# Altium schematic sheet main_sch.SchDoc
size C; SheetNumber: 1; SheetTotal: 1
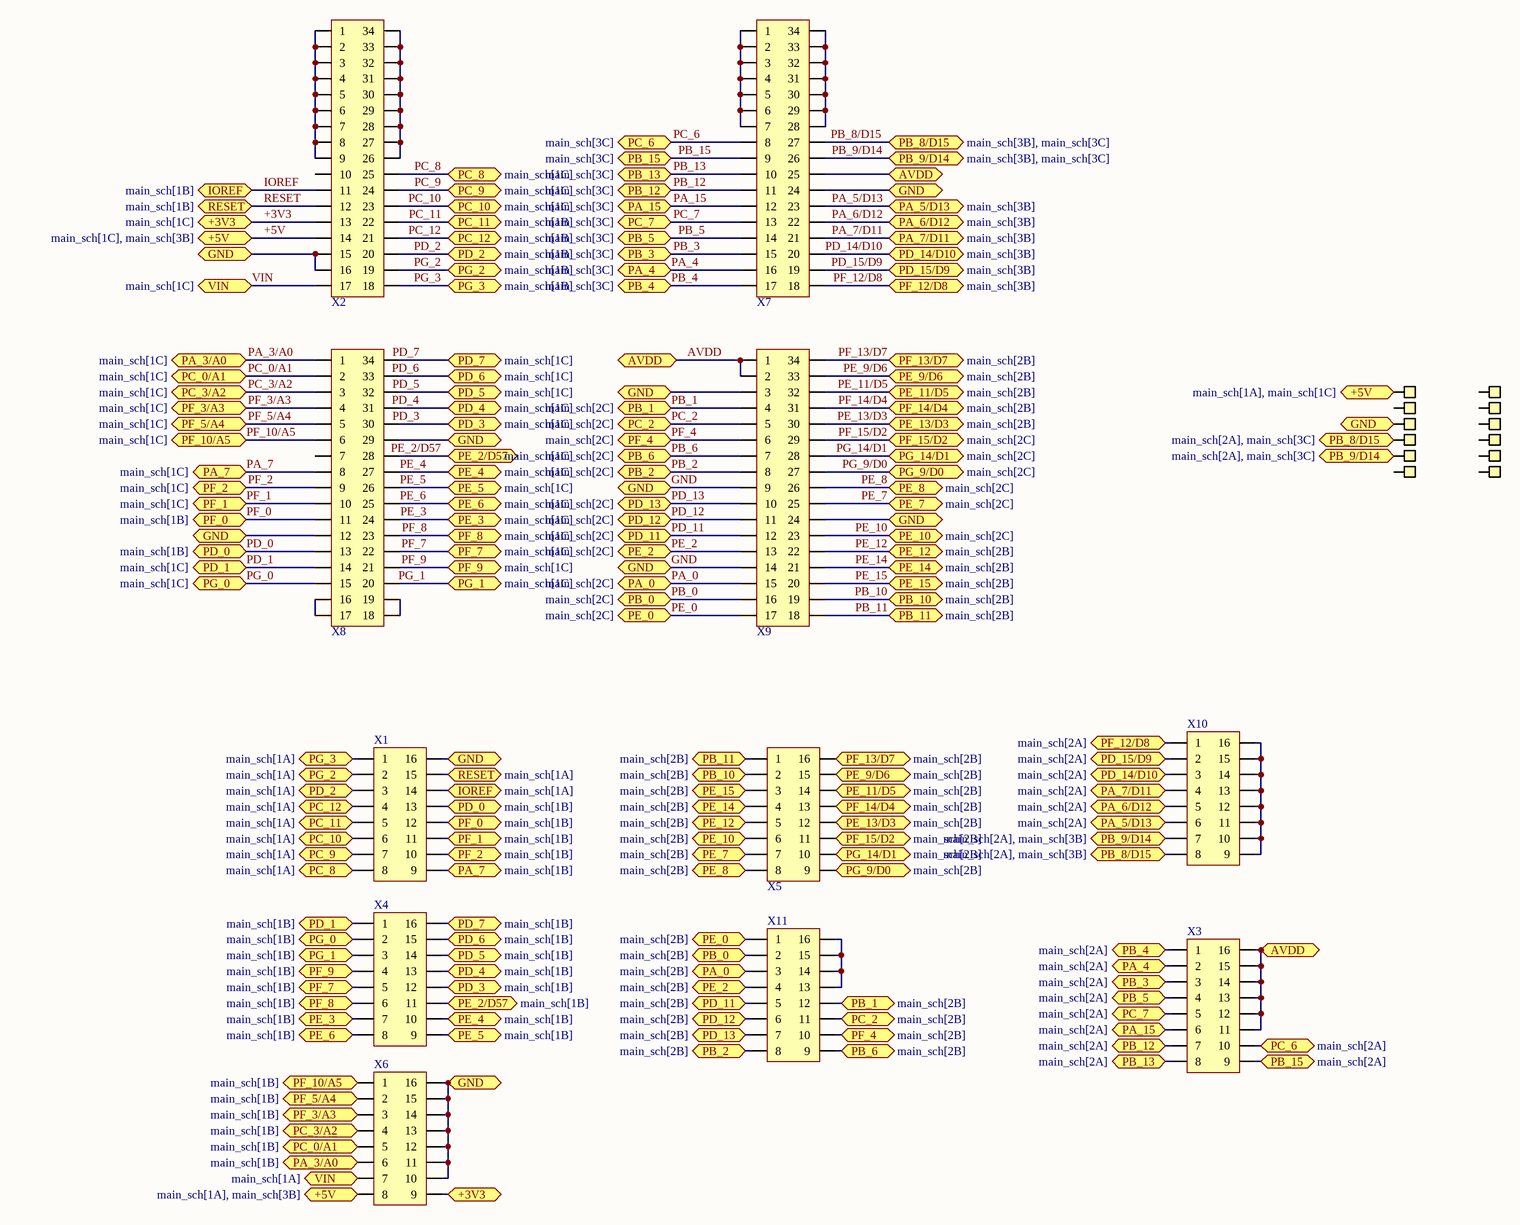
[diagram p0: main_sch.SchDoc]

## Parts
X1  TERM BLOCK 16POS 45DEG 5MM PCB  [PHEONIX-1988943]  (value not drawn)
X2  (no value)  [2x17PinHeader_0.1in]
X3  TERM BLOCK 16POS 45DEG 5MM PCB  [PHEONIX-1988943]  (value not drawn)
X4  TERM BLOCK 16POS 45DEG 5MM PCB  [PHEONIX-1988943]  (value not drawn)
X5  TERM BLOCK 16POS 45DEG 5MM PCB  [PHEONIX-1988943]  (value not drawn)
X6  TERM BLOCK 16POS 45DEG 5MM PCB  [PHEONIX-1988943]  (value not drawn)
X7  (no value)  [2x17PinHeader_0.1in]
X8  (no value)  [2x17PinHeader_0.1in]
X9  (no value)  [2x17PinHeader_0.1in]
X10  TERM BLOCK 16POS 45DEG 5MM PCB  [PHEONIX-1988943]  (value not drawn)
X11  TERM BLOCK 16POS 45DEG 5MM PCB  [PHEONIX-1988943]  (value not drawn)
X12  GenericPinHeader(0.1in)  [GenericPinHeader(.1in)]  (value not drawn)
X13  GenericPinHeader(0.1in)  [GenericPinHeader(.1in)]  (value not drawn)
X14  GenericPinHeader(0.1in)  [GenericPinHeader(.1in)]  (value not drawn)
X15  GenericPinHeader(0.1in)  [GenericPinHeader(.1in)]  (value not drawn)
X16  GenericPinHeader(0.1in)  [GenericPinHeader(.1in)]  (value not drawn)
X17  GenericPinHeader(0.1in)  [GenericPinHeader(.1in)]  (value not drawn)
X18  GenericPinHeader(0.1in)  [GenericPinHeader(.1in)]  (value not drawn)
X19  GenericPinHeader(0.1in)  [GenericPinHeader(.1in)]  (value not drawn)
X20  GenericPinHeader(0.1in)  [GenericPinHeader(.1in)]  (value not drawn)
X21  GenericPinHeader(0.1in)  [GenericPinHeader(.1in)]  (value not drawn)
X22  GenericPinHeader(0.1in)  [GenericPinHeader(.1in)]  (value not drawn)
X23  GenericPinHeader(0.1in)  [GenericPinHeader(.1in)]  (value not drawn)

## Ports
+3V3 (bidir, see main_sch[1A]), +3V3 (bidir, see main_sch[1C]), +5V (bidir, see main_sch[1A], main_sch[1C]), +5V (bidir, see main_sch[1A], main_sch[3B]), +5V (bidir, see main_sch[1C], main_sch[3B]), AVDD (bidir, see main_sch[2A], main_sch[2B]), AVDD (bidir, see main_sch[2A], main_sch[3C]), AVDD (bidir, see main_sch[2B], main_sch[3C]), GND (bidir, see main_sch[1A], main_sch[1B], main_sch[1C], main_sch[2A], main_sch[2B]), GND (bidir, see main_sch[1A], main_sch[1B], main_sch[1C], main_sch[2A], main_sch[2B], main_sch[3B]), GND (bidir, see main_sch[1A], main_sch[1B], main_sch[1C], main_sch[2B], main_sch[3B]), GND (bidir, see main_sch[1A], main_sch[1B], main_sch[2A], main_sch[2B], main_sch[3B]), GND (bidir, see main_sch[1B], main_sch[1C], main_sch[2A], main_sch[2B], main_sch[3B]), IOREF (bidir, see main_sch[1A]), IOREF (bidir, see main_sch[1B]), PA_0 (bidir, see main_sch[2B]), PA_0 (bidir, see main_sch[2C]), PA_3/A0 (bidir, see main_sch[1B]), PA_3/A0 (bidir, see main_sch[1C]), PA_4 (bidir, see main_sch[2A]), PA_4 (bidir, see main_sch[3C]), PA_5/D13 (bidir, see main_sch[2A]), PA_5/D13 (bidir, see main_sch[3B]), PA_6/D12 (bidir, see main_sch[2A]), PA_6/D12 (bidir, see main_sch[3B]), PA_7 (bidir, see main_sch[1B]), PA_7 (bidir, see main_sch[1C]), PA_7/D11 (bidir, see main_sch[2A]), PA_7/D11 (bidir, see main_sch[3B]), PA_15 (bidir, see main_sch[2A]), PA_15 (bidir, see main_sch[3C]), PB_0 (bidir, see main_sch[2B]), PB_0 (bidir, see main_sch[2C]), PB_1 (bidir, see main_sch[2B]), PB_1 (bidir, see main_sch[2C]), PB_2 (bidir, see main_sch[2B]), PB_2 (bidir, see main_sch[2C]), PB_3 (bidir, see main_sch[2A]), PB_3 (bidir, see main_sch[3C]), PB_4 (bidir, see main_sch[2A]), PB_4 (bidir, see main_sch[3C]), PB_5 (bidir, see main_sch[2A]), PB_5 (bidir, see main_sch[3C]), PB_6 (bidir, see main_sch[2B]), PB_6 (bidir, see main_sch[2C]), PB_8/D15 (bidir, see main_sch[2A], main_sch[3B]), PB_8/D15 (bidir, see main_sch[2A], main_sch[3C]), PB_8/D15 (bidir, see main_sch[3B], main_sch[3C]), PB_9/D14 (bidir, see main_sch[2A], main_sch[3B]), PB_9/D14 (bidir, see main_sch[2A], main_sch[3C]), PB_9/D14 (bidir, see main_sch[3B], main_sch[3C]), PB_10 (bidir, see main_sch[2B]), PB_11 (bidir, see main_sch[2B]), PB_12 (bidir, see main_sch[2A]), PB_12 (bidir, see main_sch[3C]), PB_13 (bidir, see main_sch[2A]), PB_13 (bidir, see main_sch[3C]), PB_15 (bidir, see main_sch[2A]), PB_15 (bidir, see main_sch[3C]), PC_0/A1 (bidir, see main_sch[1B]), PC_0/A1 (bidir, see main_sch[1C]), PC_2 (bidir, see main_sch[2B]), PC_2 (bidir, see main_sch[2C]), PC_3/A2 (bidir, see main_sch[1B]), PC_3/A2 (bidir, see main_sch[1C]), PC_6 (bidir, see main_sch[2A]), PC_6 (bidir, see main_sch[3C]), PC_7 (bidir, see main_sch[2A]), PC_7 (bidir, see main_sch[3C]), PC_8 (bidir, see main_sch[1A]), PC_8 (bidir, see main_sch[1C]), PC_9 (bidir, see main_sch[1A]), PC_9 (bidir, see main_sch[1C]), PC_10 (bidir, see main_sch[1A]), PC_10 (bidir, see main_sch[1C]), PC_11 (bidir, see main_sch[1A]), PC_11 (bidir, see main_sch[1B]), PC_12 (bidir, see main_sch[1A]), PC_12 (bidir, see main_sch[1B]), PD_0 (bidir, see main_sch[1B]), PD_1 (bidir, see main_sch[1B]), PD_1 (bidir, see main_sch[1C]), PD_2 (bidir, see main_sch[1A]), PD_2 (bidir, see main_sch[1B]), PD_3 (bidir, see main_sch[1B]), PD_3 (bidir, see main_sch[1C]), PD_4 (bidir, see main_sch[1B]), PD_4 (bidir, see main_sch[1C]), PD_5 (bidir, see main_sch[1B]), PD_5 (bidir, see main_sch[1C]), PD_6 (bidir, see main_sch[1B]), PD_6 (bidir, see main_sch[1C]), PD_7 (bidir, see main_sch[1B]), PD_7 (bidir, see main_sch[1C]), PD_11 (bidir, see main_sch[2B]), PD_11 (bidir, see main_sch[2C]), PD_12 (bidir, see main_sch[2B]), PD_12 (bidir, see main_sch[2C]), PD_13 (bidir, see main_sch[2B]), PD_13 (bidir, see main_sch[2C]), PD_14/D10 (bidir, see main_sch[2A]), PD_14/D10 (bidir, see main_sch[3B]), PD_15/D9 (bidir, see main_sch[2A]), PD_15/D9 (bidir, see main_sch[3B]), PE_0 (bidir, see main_sch[2B]), PE_0 (bidir, see main_sch[2C]), PE_2 (bidir, see main_sch[2B]), PE_2 (bidir, see main_sch[2C]), PE_2/D57 (bidir, see main_sch[1B]), PE_2/D57 (bidir, see main_sch[1C]), PE_3 (bidir, see main_sch[1B]), PE_3 (bidir, see main_sch[1C]), PE_4 (bidir, see main_sch[1B]), PE_4 (bidir, see main_sch[1C]), PE_5 (bidir, see main_sch[1B]), PE_5 (bidir, see main_sch[1C]), PE_6 (bidir, see main_sch[1B]), PE_6 (bidir, see main_sch[1C]), PE_7 (bidir, see main_sch[2B]), PE_7 (bidir, see main_sch[2C]), PE_8 (bidir, see main_sch[2B]), PE_8 (bidir, see main_sch[2C]), PE_9/D6 (bidir, see main_sch[2B]), PE_10 (bidir, see main_sch[2B]), PE_10 (bidir, see main_sch[2C]), PE_11/D5 (bidir, see main_sch[2B]), PE_12 (bidir, see main_sch[2B]), PE_13/D3 (bidir, see main_sch[2B]), PE_14 (bidir, see main_sch[2B]), PE_15 (bidir, see main_sch[2B]), PF_0 (bidir, see main_sch[1B]), PF_1 (bidir, see main_sch[1B]), PF_1 (bidir, see main_sch[1C]), PF_2 (bidir, see main_sch[1B]), PF_2 (bidir, see main_sch[1C]), PF_3/A3 (bidir, see main_sch[1B]), PF_3/A3 (bidir, see main_sch[1C]), PF_4 (bidir, see main_sch[2B]), PF_4 (bidir, see main_sch[2C]), PF_5/A4 (bidir, see main_sch[1B]), PF_5/A4 (bidir, see main_sch[1C]), PF_7 (bidir, see main_sch[1B]), PF_7 (bidir, see main_sch[1C]), PF_8 (bidir, see main_sch[1B]), PF_8 (bidir, see main_sch[1C]), PF_9 (bidir, see main_sch[1B]), PF_9 (bidir, see main_sch[1C]), PF_10/A5 (bidir, see main_sch[1B]), PF_10/A5 (bidir, see main_sch[1C]), PF_12/D8 (bidir, see main_sch[2A]), PF_12/D8 (bidir, see main_sch[3B]), PF_13/D7 (bidir, see main_sch[2B]), PF_14/D4 (bidir, see main_sch[2B]), PF_15/D2 (bidir, see main_sch[2B]), PF_15/D2 (bidir, see main_sch[2C]), PG_0 (bidir, see main_sch[1B]), PG_0 (bidir, see main_sch[1C]), PG_1 (bidir, see main_sch[1B]), PG_1 (bidir, see main_sch[1C]), PG_2 (bidir, see main_sch[1A]), PG_2 (bidir, see main_sch[1B]), PG_3 (bidir, see main_sch[1A]), PG_3 (bidir, see main_sch[1B]), PG_9/D0 (bidir, see main_sch[2B]), PG_9/D0 (bidir, see main_sch[2C]), PG_14/D1 (bidir, see main_sch[2B]), PG_14/D1 (bidir, see main_sch[2C]), RESET (bidir, see main_sch[1A]), RESET (bidir, see main_sch[1B]), VIN (bidir, see main_sch[1A]), VIN (bidir, see main_sch[1C])

## Nets
+3V3: X2.13 X6.9 ; port +3V3
+5V: X2.14 X6.8 X12.1(Pin) ; port +5V
AVDD: X3.11 X3.12 X3.13 X3.14 X3.15 X3.16 X7.25 X9.1 X9.2 ; port AVDD
GND: X1.16 X2.15 X2.16 X6.10 X6.11 X6.12 X6.13 X6.14 X6.15 X6.16 X7.24 X8.12 X8.29 X9.3 X9.9 X9.14 X9.24 X16.1(Pin) ; port GND
IOREF: X1.14 X2.11 ; port IOREF
PA_0: X9.15 X11.3 ; port PA_0
PA_3/A0: X6.6 X8.1 ; port PA_3/A0
PA_4: X3.2 X7.16 ; port PA_4
PA_5/D13: X7.23 X10.6 ; port PA_5/D13
PA_6/D12: X7.22 X10.5 ; port PA_6/D12
PA_7: X1.9 X8.8 ; port PA_7
PA_7/D11: X7.21 X10.4 ; port PA_7/D11
PA_15: X3.6 X7.12 ; port PA_15
PB_0: X9.16 X11.2 ; port PB_0
PB_1: X9.4 X11.12 ; port PB_1
PB_2: X9.8 X11.8 ; port PB_2
PB_3: X3.3 X7.15 ; port PB_3
PB_4: X3.1 X7.17 ; port PB_4
PB_5: X3.4 X7.14 ; port PB_5
PB_6: X9.7 X11.9 ; port PB_6
PB_8/D15: X7.27 X10.8 X18.1(Pin) ; port PB_8/D15
PB_9/D14: X7.26 X10.7 X20.1(Pin) ; port PB_9/D14
PB_10: X5.2 X9.19 ; port PB_10
PB_11: X5.1 X9.18 ; port PB_11
PB_12: X3.7 X7.11 ; port PB_12
PB_13: X3.8 X7.10 ; port PB_13
PB_15: X3.9 X7.9 ; port PB_15
PC_0/A1: X6.5 X8.2 ; port PC_0/A1
PC_2: X9.5 X11.11 ; port PC_2
PC_3/A2: X6.4 X8.3 ; port PC_3/A2
PC_6: X3.10 X7.8 ; port PC_6
PC_7: X3.5 X7.13 ; port PC_7
PC_8: X1.8 X2.25 ; port PC_8
PC_9: X1.7 X2.24 ; port PC_9
PC_10: X1.6 X2.23 ; port PC_10
PC_11: X1.5 X2.22 ; port PC_11
PC_12: X1.4 X2.21 ; port PC_12
PD_0: X1.13 X8.13 ; port PD_0
PD_1: X4.1 X8.14 ; port PD_1
PD_2: X1.3 X2.20 ; port PD_2
PD_3: X4.12 X8.30 ; port PD_3
PD_4: X4.13 X8.31 ; port PD_4
PD_5: X4.14 X8.32 ; port PD_5
PD_6: X4.15 X8.33 ; port PD_6
PD_7: X4.16 X8.34 ; port PD_7
PD_11: X9.12 X11.5 ; port PD_11
PD_12: X9.11 X11.6 ; port PD_12
PD_13: X9.10 X11.7 ; port PD_13
PD_14/D10: X7.20 X10.3 ; port PD_14/D10
PD_15/D9: X7.19 X10.2 ; port PD_15/D9
PE_0: X9.17 X11.1 ; port PE_0
PE_2: X9.13 X11.4 ; port PE_2
PE_2/D57: X4.11 X8.28 ; port PE_2/D57
PE_3: X4.7 X8.24 ; port PE_3
PE_4: X4.10 X8.27 ; port PE_4
PE_5: X4.9 X8.26 ; port PE_5
PE_6: X4.8 X8.25 ; port PE_6
PE_7: X5.7 X9.25 ; port PE_7
PE_8: X5.8 X9.26 ; port PE_8
PE_9/D6: X5.15 X9.33 ; port PE_9/D6
PE_10: X5.6 X9.23 ; port PE_10
PE_11/D5: X5.14 X9.32 ; port PE_11/D5
PE_12: X5.5 X9.22 ; port PE_12
PE_13/D3: X5.12 X9.30 ; port PE_13/D3
PE_14: X5.4 X9.21 ; port PE_14
PE_15: X5.3 X9.20 ; port PE_15
PF_0: X1.12 X8.11 ; port PF_0
PF_1: X1.11 X8.10 ; port PF_1
PF_2: X1.10 X8.9 ; port PF_2
PF_3/A3: X6.3 X8.4 ; port PF_3/A3
PF_4: X9.6 X11.10 ; port PF_4
PF_5/A4: X6.2 X8.5 ; port PF_5/A4
PF_7: X4.5 X8.22 ; port PF_7
PF_8: X4.6 X8.23 ; port PF_8
PF_9: X4.4 X8.21 ; port PF_9
PF_10/A5: X6.1 X8.6 ; port PF_10/A5
PF_12/D8: X7.18 X10.1 ; port PF_12/D8
PF_13/D7: X5.16 X9.34 ; port PF_13/D7
PF_14/D4: X5.13 X9.31 ; port PF_14/D4
PF_15/D2: X5.11 X9.29 ; port PF_15/D2
PG_0: X4.2 X8.15 ; port PG_0
PG_1: X4.3 X8.20 ; port PG_1
PG_2: X1.2 X2.19 ; port PG_2
PG_3: X1.1 X2.18 ; port PG_3
PG_9/D0: X5.9 X9.27 ; port PG_9/D0
PG_14/D1: X5.10 X9.28 ; port PG_14/D1
RESET: X1.15 X2.12 ; port RESET
VIN: X2.17 X6.7 ; port VIN
NetX2_1: X2.1 X2.2 X2.3 X2.4 X2.5 X2.6 X2.7 X2.8 X2.9
NetX2_26: X2.26 X2.27 X2.28 X2.29 X2.30 X2.31 X2.32 X2.33 X2.34
NetX7_1: X7.1 X7.2 X7.3 X7.4 X7.5 X7.6 X7.7
NetX7_28: X7.28 X7.29 X7.30 X7.31 X7.32 X7.33 X7.34
NetX8_16: X8.16 X8.17
NetX8_18: X8.18 X8.19
NetX10_9: X10.9 X10.10 X10.11 X10.12 X10.13 X10.14 X10.15 X10.16
NetX11_13: X11.13 X11.14 X11.15 X11.16

Not connected (* = marked no-connect by the designer): X2 10; X8 7; X13 1(Pin); X14 1(Pin); X15 1(Pin); X17 1(Pin); X19 1(Pin); X21 1(Pin); X22 1(Pin); X23 1(Pin)

## Library data of the parts
X1 X3-X6 X10 X11 = PHEONIX-1988943: 16 Position Wire to Board Terminal Block 45° (135°) Angle with Board 0.197" (5.00mm) Through Hole; ComponentLink1Description: DIGIKEY; ComponentLink1URL: https://www.digikey.com/en/products/detail/phoenix-contact/1988943/950906
X2 X7-X9 = 2x17_0.1in: Generic 2x17 0.1in pitch pin header
X12-X23 = GenericPinHeader(0.1in): Generic .1in(2.54mm) pitch pin header